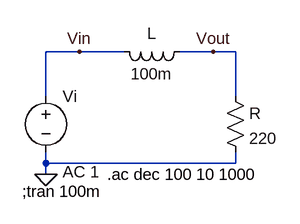
[diagram p0: schematic Draft15.asc]
Draft15.asc, the LTspice schematic file:
Version 4
SHEET 1 880 680
WIRE 128 80 80 80
WIRE 192 80 128 80
WIRE 320 80 272 80
WIRE 352 80 320 80
WIRE 80 144 80 80
WIRE 352 144 352 80
WIRE 80 240 80 224
WIRE 352 240 352 224
WIRE 352 240 80 240
WIRE 80 256 80 240
FLAG 80 256 0
FLAG 128 80 Vin
FLAG 320 80 Vout
SYMBOL voltage 80 128 R0
WINDOW 123 24 124 Left 2
WINDOW 39 0 0 Left 0
SYMATTR InstName Vi
SYMATTR Value ""
SYMATTR Value2 AC 1
SYMBOL res 336 128 R0
SYMATTR InstName R
SYMATTR Value 220
SYMATTR SpiceLine tol=1 pwr=0.1
SYMBOL ind 288 64 R90
WINDOW 0 5 56 VBottom 2
WINDOW 3 32 56 VTop 2
SYMATTR InstName L
SYMATTR Value 100m
TEXT 46 280 Left 2 !;tran 100m
TEXT 168 256 Left 2 !.ac dec 100 10 1000

The netlist it stands for:
* Draft15.asc
Vi Vin 0 AC 1
R Vout 0 220 tol=1 pwr=0.1
L Vout Vin 100m
;tran 100m
.ac dec 100 10 1000
.backanno
.end

* Results of the author's LTspice run, read from the files saved beside the schematic
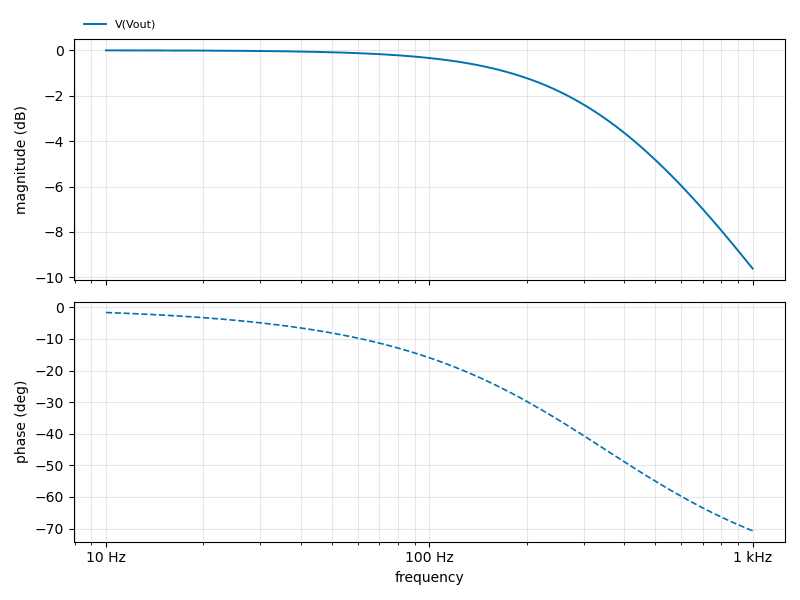
[diagram p1: AC Analysis of Draft15.asc, plotted from the saved traces]
* AC Analysis, 1 run:
*   V(Vout): -0.00 dB at 10 Hz, -9.62 dB at 1 kHz, peak -0.00 dB at 10 Hz, 3 dB below the peak at 350.4 Hz